# Altium project EMAX_12A.PrjPcb
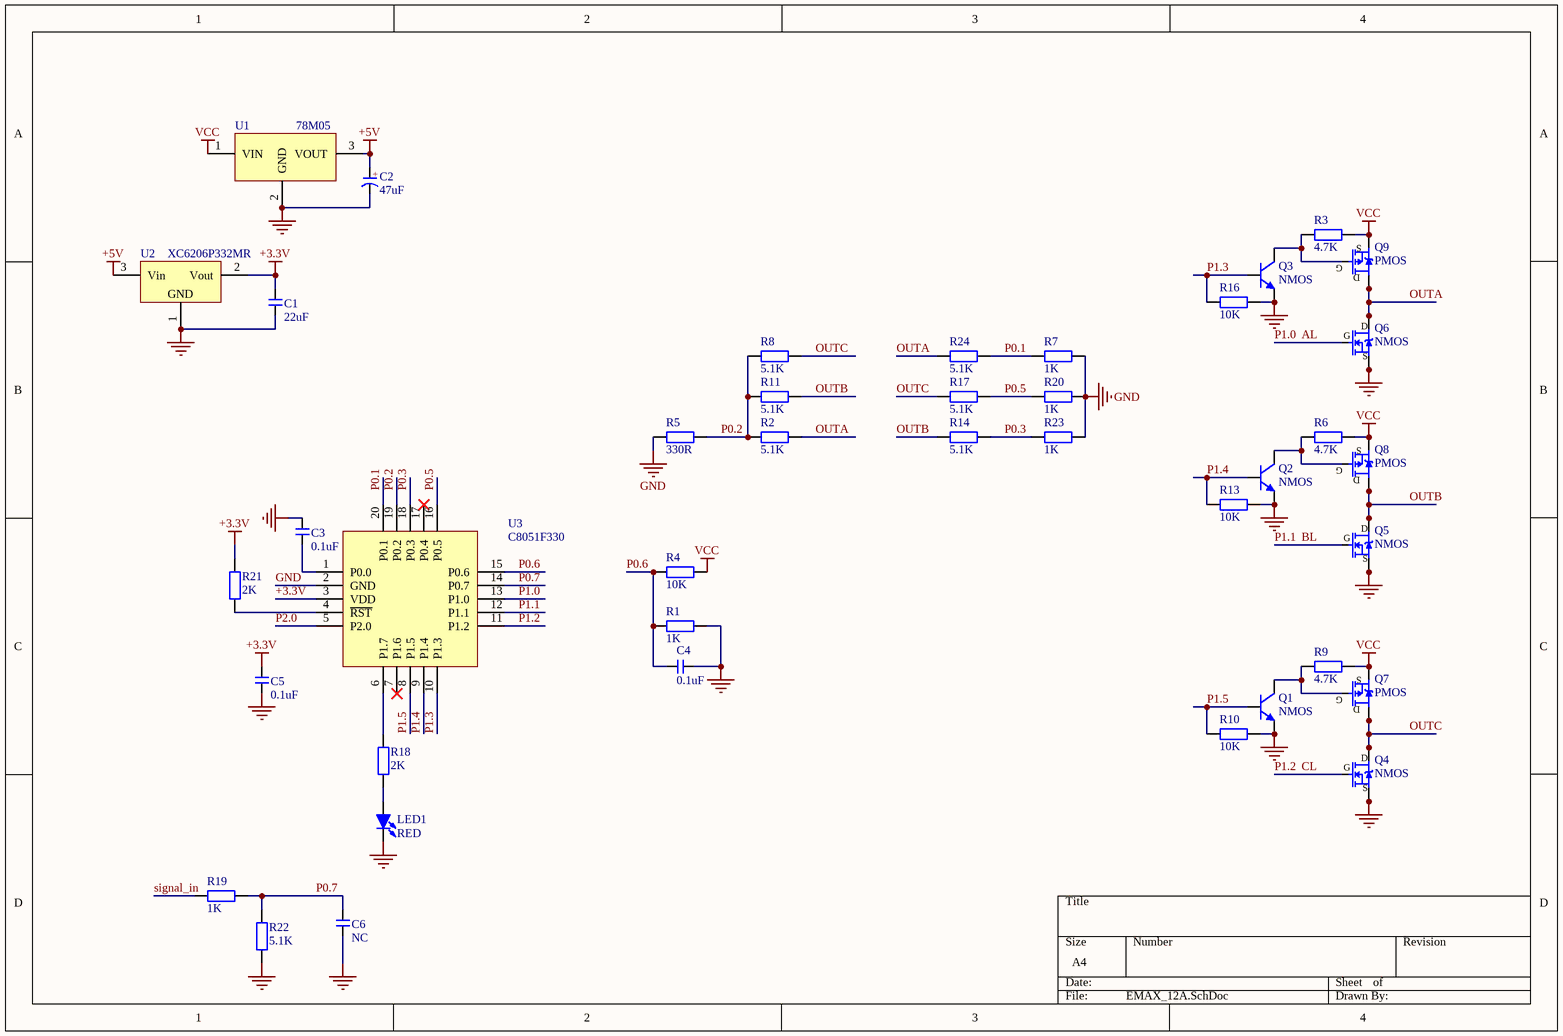
[diagram p0: EMAX_12A.SchDoc]
1 sheet, 41 parts. Net scope: global (net labels, ports and power ports of the same name join across sheets).
Board file: EMAX_12A_PCB.PcbDoc

## Sheet EMAX_12A.SchDoc
size A4; SheetNumber: 1; SheetTotal: 1

### Parts
C1  22uF  [C 1206_L]
C2  47uF  [CD B(3528)]
C3  0.1uF  [C 0603_L]
C4  0.1uF  [C 0603_L]
C5  0.1uF  [C 0603_L]
C6  NC  [C 0603_L]
LED1  RED  [LED 0603R]
Q1  NMOS  [LC-SOT-23(SOT-23-3)]
Q2  NMOS  [LC-SOT-23(SOT-23-3)]
Q3  NMOS  [LC-SOT-23(SOT-23-3)]
Q4  NMOS  [LC-SOP-8_150mil]
Q5  NMOS  [LC-SOP-8_150mil]
Q6  NMOS  [LC-SOP-8_150mil]
Q7  PMOS  [LC-SOP-8_150mil]
Q8  PMOS  [LC-SOP-8_150mil]
Q9  PMOS  [LC-SOP-8_150mil]
R1  1K  [R 0603_L]
R2  5.1K  [R 0603_L]
R3  4.7K  [R 0603_L]
R4  10K  [R 0603_L]
R5  330R  [R 0603_L]
R6  4.7K  [R 0603_L]
R7  1K  [R 0603_L]
R8  5.1K  [R 0603_L]
R9  4.7K  [R 0603_L]
R10  10K  [R 0603_L]
R11  5.1K  [R 0603_L]
R13  10K  [R 0603_L]
R14  5.1K  [R 0603_L]
R16  10K  [R 0603_L]
R17  5.1K  [R 0603_L]
R18  2K  [R 0603_L]
R19  1K  [R 0603_L]
R20  1K  [R 0603_L]
R21  2K  [R 0603_L]
R22  5.1K  [R 0603_L]
R23  1K  [R 0603_L]
R24  5.1K  [R 0603_L]
U1  78M05  [LC-TO-252-2]
U2  XC6206P332MR  [LC-SOT-23(SOT-23-3)]
U3  C8051F330  [LC-QFN-20_4x4x05P]

### Nets
+3.3V: C1.2 C5.2 R21.1 U2.2(Vout) U3.3(VDD)
+5V: C2.1(A) U1.3(VOUT) U2.3(Vin)
GND: C1.1 C2.2(K) C3.2 C4.2 C5.1 C6.1 LED1.2(K) Q1.2(E) Q2.2(E) Q3.2(E) Q4.1(S) Q4.2(S) Q4.3(S) Q5.1(S) Q5.2(S) Q5.3(S) Q6.1(S) Q6.2(S) Q6.3(S) R1.2 R5.1 R7.2 R10.2 R13.2 R16.1 R20.2 R22.2 R23.2 U1.2(GND) U2.1(GND) U3.2(GND)
VCC: Q7.1(S) Q7.2(S) Q7.3(S) Q8.1(S) Q8.2(S) Q8.3(S) Q9.1(S) Q9.2(S) Q9.3(S) R3.1 R4.2 R6.1 R9.1 U1.1(VIN)
AL: Q6.4(G) U3.13(P1.0)  [also labelled P1.0]
BL: Q5.4(G) U3.12(P1.1)  [also labelled P1.1]
CL: Q4.4(G) U3.11(P1.2)  [also labelled P1.2]
OUTA: Q6.5(D) Q6.6(D) Q6.7(D) Q6.8(D) Q9.5(D) Q9.6(D) Q9.7(D) Q9.8(D) R2.2 R24.2
OUTB: Q5.5(D) Q5.6(D) Q5.7(D) Q5.8(D) Q8.5(D) Q8.6(D) Q8.7(D) Q8.8(D) R11.2 R14.1
OUTC: Q4.5(D) Q4.6(D) Q4.7(D) Q4.8(D) Q7.5(D) Q7.6(D) Q7.7(D) Q7.8(D) R8.2 R17.1
P0.1: R7.1 R24.1 U3.20(P0.1)
P0.2: R2.1 R5.2 R8.1 R11.1 U3.19(P0.2)
P0.3: R14.2 R23.1 U3.18(P0.3)
P0.5: R17.2 R20.1 U3.16(P0.5)
P0.6: C4.1 R1.1 R4.1 U3.15(P0.6)
P0.7: C6.2 R19.2 R22.1 U3.14(P0.7)
P1.3: Q3.1(B) R16.2 U3.10(P1.3)
P1.4: Q2.1(B) R13.1 U3.9(P1.4)
P1.5: Q1.1(B) R10.1 U3.8(P1.5)
P2.0: U3.5(P2.0)
signal_in: R19.1
NetC3_1: C3.1 U3.1(P0.0)
NetLED1_1: LED1.1(A) R18.1
NetQ1_3: Q1.3(C) Q7.4(G) R9.2
NetQ2_3: Q2.3(C) Q8.4(G) R6.2
NetQ3_3: Q3.3(C) Q9.4(G) R3.2
NetR18_2: R18.2 U3.6(P1.7)
NetR21_2: R21.2 U3.4(~{RST})

Not connected (* = marked no-connect by the designer): U3 7(P1.6)* 17(P0.4)*

### Notes on the sheet
- (in symbol C-CD) +

### Library data of the parts
C1 C3-C6 = C: 无极性贴片电容; 版权归属: 源创客; 材质: X7R; BOM名称: 无极性贴片电容; 学习资源: www.ooocke.com
C2 = C-CD: 贴片钽电容; 版权归属: 源创客; BOM名称: 贴片钽电容; 学习资源: www.ooocke.com
LED1 = LED-SMD: 贴片LED; 版权归属: 源创客; BOM名称: 贴片LED; 学习资源: www.ooocke.com
Q1-Q3 = 8050-SMD: 高频放大-NPN型; 版权归属: 源创客; 属性: 40V 1.5A 1W 100MHZ; BOM名称: 高频放大-NPN型; 学习资源: www.ooocke.com
Q4-Q6 = NMOS_DFN8_5x6: BOM名称: 效应管; 版权归属: 源创客; 描述: N沟场 100V/22A; 学习资源: www.ooocke.com
Q7-Q9 = PMOS_DFN8_5x6: BOM名称: 效应管; 版权归属: 源创客; 描述: N沟场 100V/22A; 学习资源: www.ooocke.com
R1-R11 R13 R14 R16-R24 = R: 贴片电阻; 版权归属: 源创客; BOM名称: 贴片电阻; 学习资源: www.ooocke.com
U1 = 78xx: 线性稳压芯片; 版权归属: 源创客; BOM名称: 线性稳压芯片; 学习资源: www.ooocke.com
U2 = XC6206P332MR: 低压差线性稳压芯片; 版权归属: 源创客; BOM名称: 低压差线性稳压芯片; 学习资源: www.ooocke.com